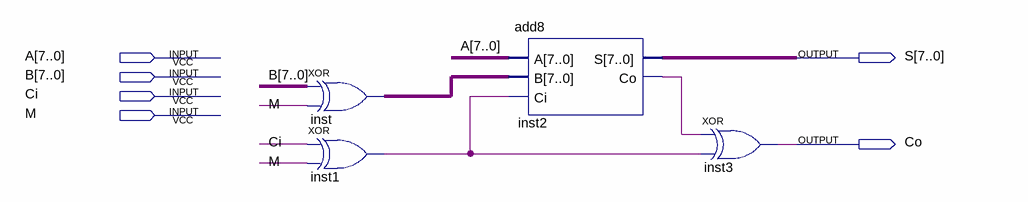
[diagram p0: schematic sheet]
// Quartus schematic addsub8.bdf as structural Verilog: 4 symbols, 6 pins
module addsub8 (
  input  [7:0] A,
  input  [7:0] B,
  input  Ci,
  input  M,
  output [7:0] S,
  output Co
);

  wire inst1_out, inst2_co;
  wire [7:0] inst_out;

  assign inst_out = B ^ {8{M}};  // XOR inst, 8 bits wide
  xor inst1 (inst1_out, Ci, M);
  add8 inst2 (.A(A), .B(inst_out), .Ci(inst1_out), .S(S), .Co(inst2_co));
  xor inst3 (Co, inst2_co, inst1_out);
endmodule
